# Altium schematic sheet Sheet2motorcontrol.SchDoc
size A
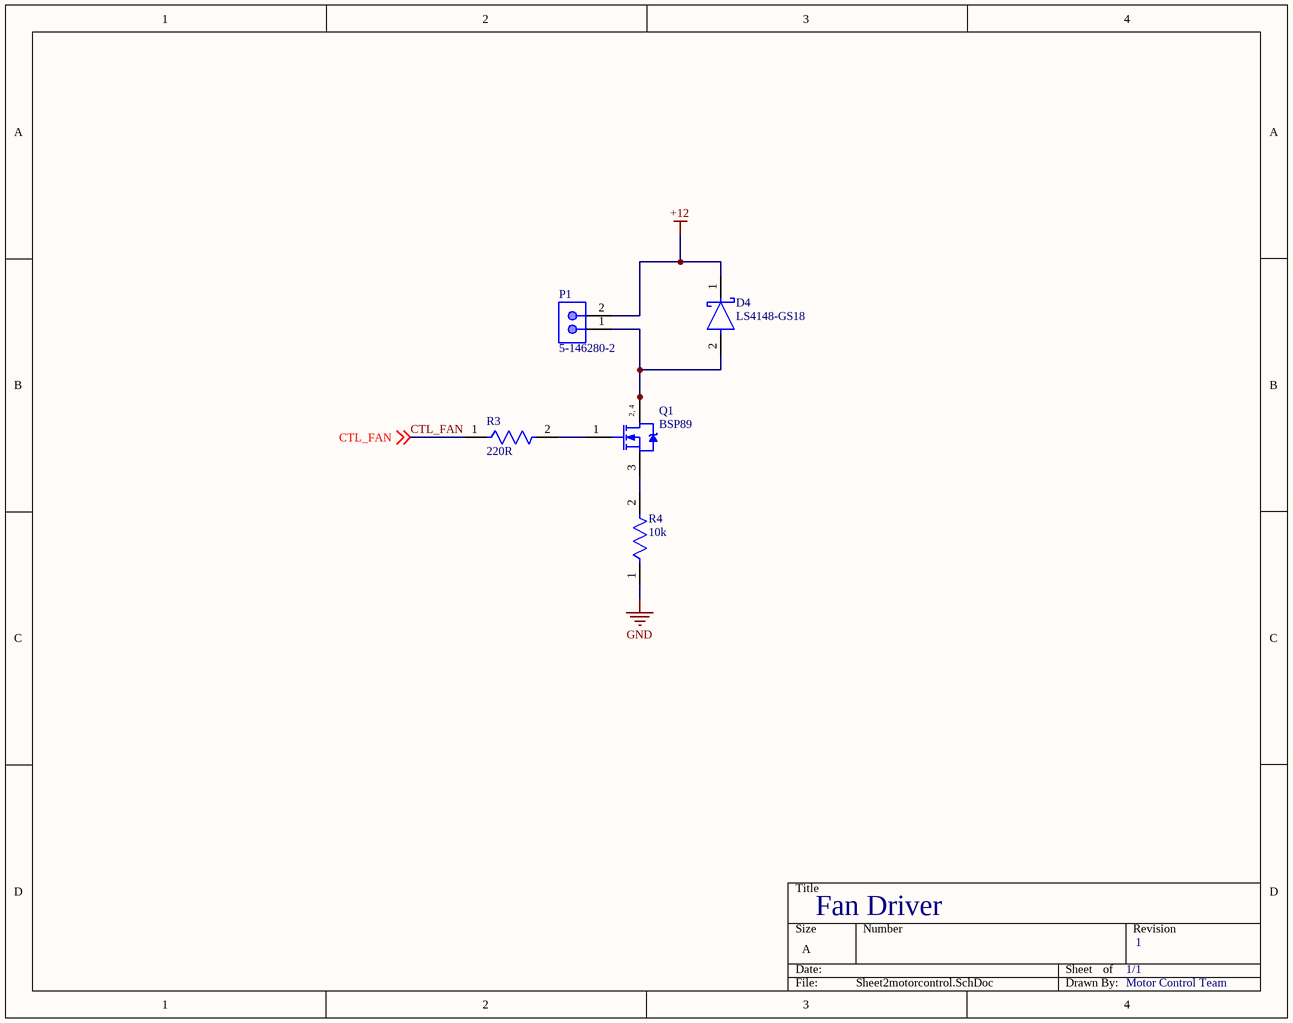
[diagram p0: Sheet2motorcontrol.SchDoc]

## Parts
D4  LS4148-GS18  [FP-6_560-5006_01-4-MFG]
P1  5-146280-2  [TECO-5-146280-2_V]
Q1  BSP89  [INF-PG-SOT223_SC-73_M]
R3  220R  [FP-CR1206-MFG]
R4  10k  [FP-CR1206-MFG]

## Nets
+12: D4.1(C) P1.2
GND: R4.1
CTL_FAN: R3.1 ; off-sheet CTL_FAN
NetD4_2: D4.2(A) P1.1 Q1.2(DRAIN) Q1.4(DRAIN)
NetQ1_1: Q1.1(GATE) R3.2
NetQ1_3: Q1.3(SOURCE) R4.2

## Notes on the sheet
- Fan Driver
- 1/1
- 1
- Motor Control Team
- (in symbol CMP-1149-00010-1) 2, 4

## Library data of the parts
D4 = CMP-02539-000014-1: DIODE GEN PURP 75V 150MA SOD80; Manufacturer: Vishay; Capacitance: 4pF; Max Surge Forward Current: 2A; Forward Current: 300mA; Max Repetitive Reverse Voltage: 100V; Max Junction Temp: +175°C; Peak Reverse Current: 5uA; Value: 4pF; Automotive Grade: Grade 0; Device Class L2: Diodes; Digikey Description: DIODE GEN PURP 75V 150MA SOD80; Lead Free: Yes; Device Class L1: Discrete Semiconductors; Mouser Description: In a Pack of 100, Vishay Switching Diode, 300mA 75V, 2-Pin SOD-80 LS4148-GS18; Package: 6.560-5006.01-4; RoHS: TRUE; Temperature Range High: +175°C; ComponentLink2URL: http://www.vishay.com/docs/85561/ls4148.pdf; Temperature: to +175°C; Manufacturer Part Number: LS4148-GS18; Device Class L3: Schottky Diodes; Automotive: Yes; ComponentLink2Description: Datasheet; Reverse Voltage: 75V; Height: 1.7mm; Category: Diode; Octopart: https://octopart.com/ls4148-gs18-vishay-55507867
P1 = CMP-2000-07492-1: Male Header, Pitch 2.54 mm, 1 x 2 Position, Height 8.21 mm, Tail Length 3.05 mm, -65 to 105 degC, RoHS, Bulk; Manufacturer: TE Connectivity; Mating Connector Lock: No(Without); Number of Positions: 2; Pitch: 2.54mm; PCB Mounting Orientation: Vertical; Keyed: No; Case\/Package: 100; Mating Post Length: 0.23inch; High Temperature Housing: Yes; Max Current Rating: 5A; PCB Thickness: 0.063inch; PCB Mount Retention: Without; Approvals: CSA; Current Rating: 3A; Radiation Hardening: No; Length: 4.67mm; Contact Mating Length: 0.23inch; Connector Type: Header; Number of Rows: 1; Termination Post Length: 0.12inch; Board Standoff: No(Without); Max Operating Temperature: 105degC; Contact Shape: Square; Selectively Loaded: No(Without); Gasket: No(Without); Number of Contacts: 2; Contact Gender: Male; Mating Alignment: No(Without); Manufacturer URL: http://www.te.com/; Datasheet URL: http://www.te.com/commerce/DocumentDelivery/DDEController?Action=showdoc&DocId=Customer+Drawing%7F146280%7FH1%7Fpdf%7FEnglish%7FENG_CD_146280_H1.pdf%7F5-146280-2; Mount: ThroughHole; Orientation: Straight; Packaging: Carton; Package Reference: 5-146280-2; Package Quantity: 500; Stabilizers: No(Without); Row Spacing: 2.54mm; Contact Material: CopperAlloy; Panel Mount Retention: No(Without); Datasheet Version: Rev. H1, 08/2016; Housing Colour: Black; Colour: Black; Package Description: Male Header, Pitch 2.54 mm, 1 x 2 Position, Height 8.21 mm, Tail Length 3.05 mm; Contact Plating: Matte; Housing Material: Polymer; Contact Protection: No(Without); Min Operating Temperature: -65degC; Mounting Technology: ThroughHole; Flammability Rating: UL94V-0; RoHSCompliant: true; Termination: ThroughHole; Depth: 2.34mm; High Speed Serial Data Connector: No
Q1 = CMP-1149-00010-1: N-Channel SIPMOS Small-Signal-Transistor, 240 V VDS, 0.35 A ID, -55 to 150 degC, PG-SOT223 (SC-73), Reel, Green; Manufacturer: Infineon; Polarity: N; Ptot (max): 1.8Â W; RDS (on) (max) (@4.5V): 7,500 mOhm; ID (max): 0.35Â A; Mode: Enhancement; VDS (max): 240 V; RthJA (max): 115 K/W; VGS(th) (min): 0.8Â V; RDS (on) (max): 6,000 mOhm; QG: 4.3Â nC; VGS(th) (max): 1.8Â V; IDpuls (max): 1.4Â A; Green: TRUE; PackageVersion: Apr-08; ComponentLink3URL: http://www.infineon.com/dgdl/SOT223-Package_Overview.pdf?folderId=db3a30431936bc4b0119530470b03c3d&fileId=db3a30431936bc4b0119531d40b93c5c; ComponentLink1URL: http://www.infineon.com/; Mounting Technology: Surface Mount; ComponentLink3Description: Package Specification; Halogen-free: TRUE; PackageReference: PG-SOT223 (SC-73); ComponentLink2Description: Datasheet; PartNumber: BSP89; ComponentLink1Description: Manufacturer URL; DatasheetVersion: Rev. 2.2; ComponentLink2URL: http://www.infineon.com/dgdl/BSP89_Rev2.2.pdf?folderId=db3a3043156fd573011622e10b5c1f67&fileId=db3a30433b47825b013b4b8a07f90d55; Packing: Reel; PackageDescription: 4-Pin Small Outline Transistor Package, 6.5 x 3.5 mm Body, 2.3 mm Pitch
R3 R4 = CMP-07231-003158-1: Thick Film Chip Resistors 1206 330Ω 0.25W 1% 100ppm/°C; Voltage Rating: 200V; Max Power Dissipation: 250mW; Resistance: 330R; Radiation Hardening: No; Length: 3.2mm; Number of Pins: 2; Composition: Thick Film; Tolerance: 1%; Case Code (Metric): 3216; Max Operating Temperature: 155°C; Number of Terminations: 2; Package Quantity: 5000; Temperature Coefficient: 100ppm/°C; Termination: SMD/SMT; Min Operating Temperature: -55°C; Military Standard: Not; Case/Package: 1206; Packaging: Tape and Reel; Case Code (Imperial): 1206; Contact Plating: Tin; Voltage Rating (DC): 200V; REACH SVHC: No SVHC; Height: 0.6mm; Thickness: 610um; Mount: Surface Mount; Depth: 1.6mm; Power Rating: 250mW; Width: 1.6mm